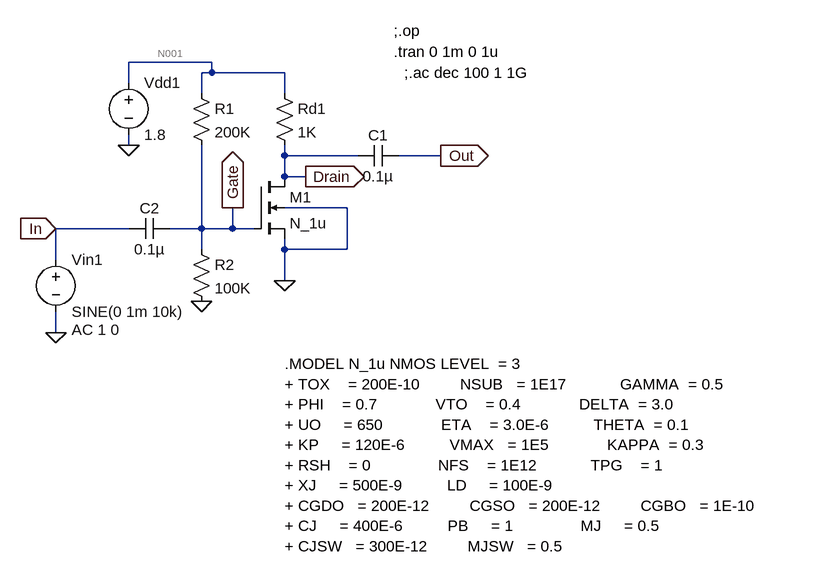
[diagram p0: schematic exam.asc]
exam.asc, the LTspice schematic file:
Version 4
SHEET 1 1140 684
WIRE 176 -48 48 -48
WIRE 176 -32 176 -48
WIRE 176 -32 160 -32
WIRE 288 -32 176 -32
WIRE 48 -16 48 -48
WIRE 160 0 160 -32
WIRE 288 0 288 -32
WIRE 48 80 48 64
WIRE 288 96 288 80
WIRE 400 96 288 96
WIRE 528 96 464 96
WIRE 288 128 288 96
WIRE 320 128 288 128
WIRE 384 176 288 176
WIRE 48 208 -64 208
WIRE 160 208 160 80
WIRE 160 208 112 208
WIRE 208 208 208 176
WIRE 208 208 160 208
WIRE 240 208 208 208
WIRE 160 240 160 208
WIRE 288 240 288 224
WIRE 384 240 384 176
WIRE 384 240 288 240
WIRE -64 256 -64 208
WIRE 288 288 288 240
WIRE -64 368 -64 336
FLAG 160 320 0
FLAG 48 80 0
FLAG -64 368 0
FLAG 528 96 Out
IOPIN 528 96 Out
FLAG 320 128 Drain
IOPIN 320 128 Out
FLAG 208 176 Gate
IOPIN 208 176 Out
FLAG 288 288 0
FLAG -64 208 In
IOPIN -64 208 In
SYMBOL res 272 -16 R0
SYMATTR InstName Rd1
SYMATTR Value 1K
SYMBOL nmos4 240 128 R0
SYMATTR InstName M1
SYMATTR Value N_1u
SYMATTR Value2 l=1u w=416u
SYMBOL res 144 -16 R0
SYMATTR InstName R1
SYMATTR Value 200K
SYMBOL res 144 224 R0
SYMATTR InstName R2
SYMATTR Value 100K
SYMBOL voltage -64 240 R0
WINDOW 123 24 124 Left 2
WINDOW 39 0 0 Left 0
SYMATTR Value2 AC 1 0
SYMATTR InstName Vin1
SYMATTR Value SINE(0 1m 10k)
SYMBOL voltage 48 -32 R0
WINDOW 123 0 0 Left 0
WINDOW 39 0 0 Left 0
SYMATTR InstName Vdd1
SYMATTR Value 1.8
SYMBOL cap 464 80 R90
WINDOW 0 0 32 VBottom 2
WINDOW 3 32 32 VTop 2
SYMATTR InstName C1
SYMATTR Value 0.1µ
SYMBOL cap 112 192 R90
WINDOW 0 0 32 VBottom 2
WINDOW 3 32 32 VTop 2
SYMATTR InstName C2
SYMATTR Value 0.1µ
TEXT 456 -96 Left 2 !;.op
TEXT 456 -64 Left 2 !.tran 0 1m 0 1u
TEXT 288 416 Left 2 !.MODEL N_1u NMOS LEVEL  = 3                  \n+ TOX    = 200E-10         NSUB   = 1E17            GAMMA  = 0.5          \n+ PHI    = 0.7             VTO    = 0.4             DELTA  = 3.0         \n+ UO     = 650             ETA    = 3.0E-6          THETA  = 0.1          \n+ KP     = 120E-6          VMAX   = 1E5             KAPPA  = 0.3                \n+ RSH    = 0               NFS    = 1E12            TPG    = 1                  \n+ XJ     = 500E-9          LD     = 100E-9                 \n+ CGDO   = 200E-12         CGSO   = 200E-12         CGBO   = 1E-10              \n+ CJ     = 400E-6          PB     = 1               MJ     = 0.5           \n+ CJSW   = 300E-12         MJSW   = 0.5
TEXT 472 -32 Left 2 !;.ac dec 100 1 1G

The netlist it stands for:
* exam.asc
Rd1 N001 Drain 1K
M1 Drain Gate 0 0 N_1u l=1u w=416u
R1 N001 Gate 200K
R2 Gate 0 100K
Vin1 In 0 SINE(0 1m 10k) AC 1 0
Vdd1 N001 0 1.8
C1 Out Drain 0.1µ
C2 Gate In 0.1µ
.model NMOS NMOS
.model PMOS PMOS
.lib standard.mos
;.op
.tran 0 1m 0 1u
.MODEL N_1u NMOS LEVEL  = 3
+ TOX    = 200E-10         NSUB   = 1E17            GAMMA  = 0.5
+ PHI    = 0.7             VTO    = 0.4             DELTA  = 3.0
+ UO     = 650             ETA    = 3.0E-6          THETA  = 0.1
+ KP     = 120E-6          VMAX   = 1E5             KAPPA  = 0.3
+ RSH    = 0               NFS    = 1E12            TPG    = 1
+ XJ     = 500E-9          LD     = 100E-9
+ CGDO   = 200E-12         CGSO   = 200E-12         CGBO   = 1E-10
+ CJ     = 400E-6          PB     = 1               MJ     = 0.5
+ CJSW   = 300E-12         MJSW   = 0.5
;.ac dec 100 1 1G
.backanno
.end

* Results of the author's LTspice run, read from the files saved beside the schematic
* Operating Point, zero values left out:
*   V(n001) = 1.8 V
*   V(drain) = 299.9 mV
*   V(gate) = 600 mV
*   V(out) = 29.99 nV
*   Id(M1) = 1.5 mA
*   Is(M1) = -1.5 mA
*   I(R2) = 6 µA
*   I(R1) = 6 µA
*   I(Rd1) = 1.5 mA
*   I(Vdd1) = -1.506 mA
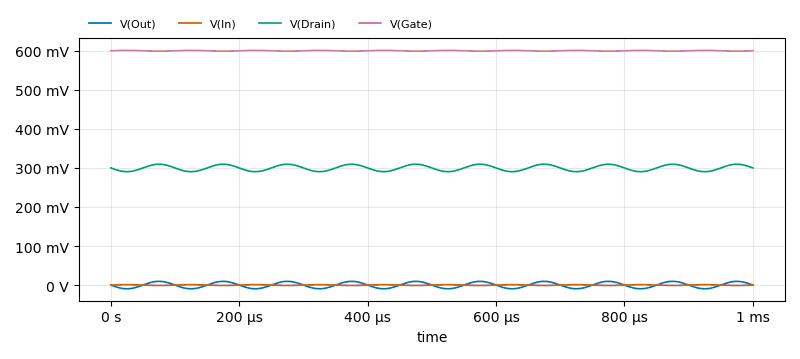
[diagram p1: Transient Analysis of exam.asc, plotted from the saved traces]
* Transient Analysis, 1 run:
*   V(Out): min -9.557 mV, max 9.556 mV, average -4.489 µV, rms 6.77 mV, last -32.56 µV
*   V(In): min -999.8 µV, max 999.8 µV, average -3.383 nV, rms 708.3 µV, last 0 V
*   V(Drain): min 290.4 mV, max 309.5 mV, average 299.9 mV, rms 300 mV, last 299.9 mV
*   V(Gate): min 599 mV, max 601 mV, average 600 mV, rms 600 mV, last 600 mV